# Altium schematic sheet Componets.SchDoc
size A3; SheetNumber: 1; SheetTotal: 8
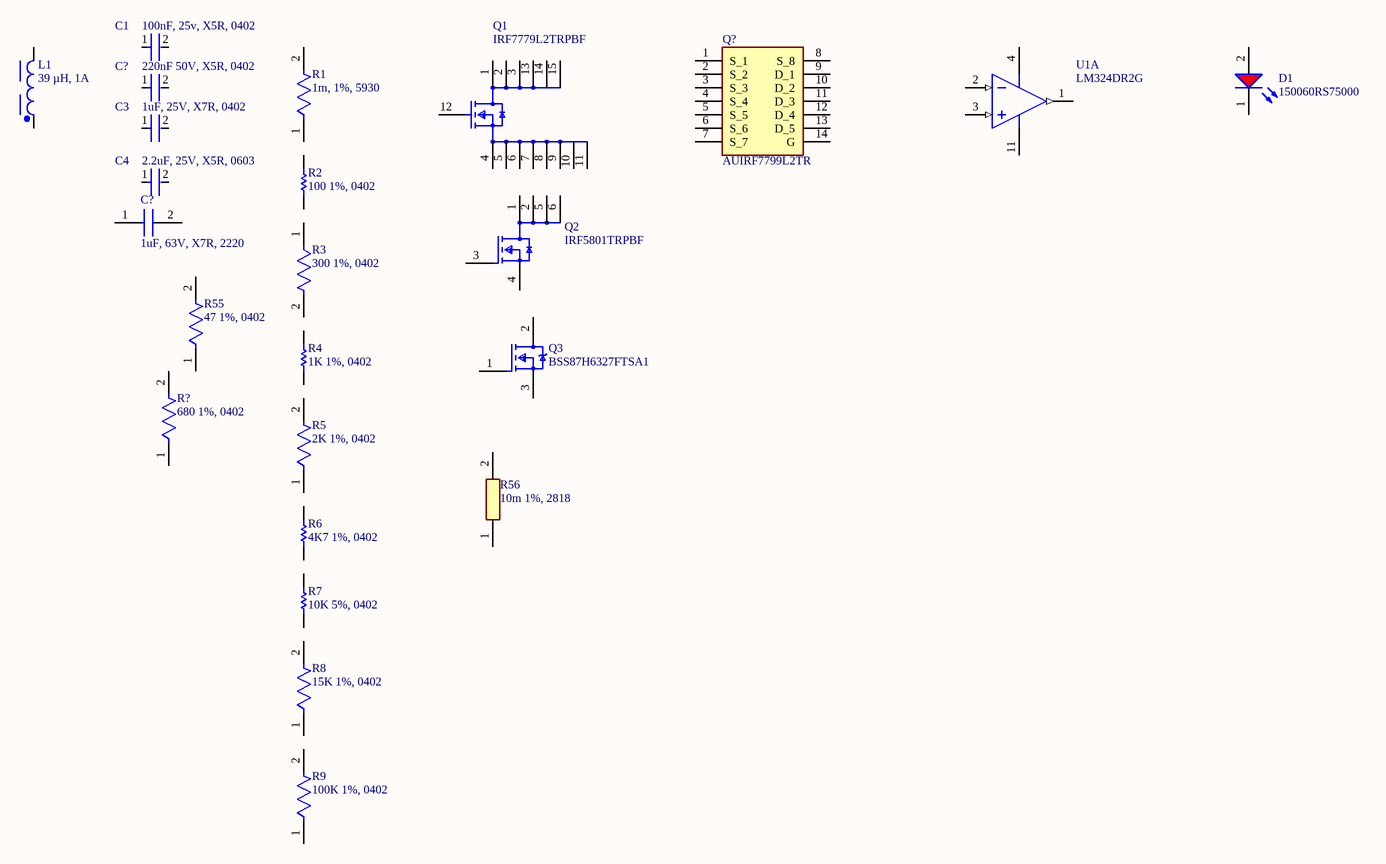
[diagram p0: Componets.SchDoc]

## Parts
(Parts that share a designator on the sheet are numbered #1, #2 ... from top to bottom, then left to right.)
C1  100nF, 25v, X5R, 0402  [FP-GRM155-0_05-IPC_C]
C3  1uF, 25V, X7R, 0402  [FP-GRM155-0_05-IPC_B]
C4  2.2uF, 25V, X5R, 0603  [FP-GRM188-0_1-e0_2_0_5-MFG]
C?#1  220nF 50V, X5R, 0402  [FP-CC0402-MFG]
C?#2  1uF, 63V, X7R, 2220  [CAPC5750X420N]
D1  150060RS75000  [WL-SMCW_0603_150060xx75000]
L1  39 µH, 1A  [WE-PD_7345]
Q1  IRF7779L2TRPBF  [FP-MG-WDSON-11-MFG]
Q2  IRF5801TRPBF  [FP-PG-TSOP-6-MFG]
Q3  BSS87H6327FTSA1  [FP-PG-SOT89-4-MFG]
Q?  AUIRF7799L2TR  [AUIRF7799L2TR]
R1  1m, 1%, 5930  [FP-CSS2H-5930K-1L00F-MFG]
R2  100 1%, 0402  [RESC1005X40X25LL05T05]
R3  300 1%, 0402  [FP-ERJ2RK-IPC_A]
R4  1K 1%, 0402  [RESC1005X40X25NL05T05]
R5  2K 1%, 0402  [FP-ERJ2RK-MFG]
R6  4K7 1%, 0402  [RESC1005X40X25LL05T05]
R7  10K 5%, 0402  [RESC1005X40X25ML05T05]
R8  15K 1%, 0402  [FP-ERJ2R-MFG]
R9  100K 1%, 0402  [FP-ERJ2RK-IPC_C]
R55  47 1%, 0402  [FP-ERJ2RK-IPC_C]
R56  10m 1%, 2818  [WSHP28181L000FEB]
R?  680 1%, 0402  [FP-ERJ2RK-MFG]
U1  LM324DR2G  [ONSC-SOIC-14-751A-03_V]  (part A of 4)

## Nets

Not connected (* = marked no-connect by the designer): C1 1 2; C3 1 2; C4 1 2; C?#1 1 2; C?#2 1 2; D1 1(K) 2(A); L1 1 2; Q1 1(Drain) 2(Drain) 3(Drain) 4(Source) 5(Source) 6(Source) 7(Source) 8(Source) 9(Source) 10(Source) 11(Source) 12(Gate) 13(Drain) 14(Drain) 15(Drain); Q2 1(D) 2(D) 3(G) 4(S) 5(D) 6(D); Q3 1(Gate) 2(Drain) 3(Source); Q? 1(S_1) 2(S_2) 3(S_3) 4(S_4) 5(S_5) 6(S_6) 7(S_7) 8(S_8) 9(D_1) 10(D_2) 11(D_3) 12(D_4) 13(D_5) 14(G); R1 1 2; R2 1 2; R3 1 2; R4 1 2; R5 1 2; R6 1 2; R7 1 2; R8 1 2; R9 1 2; R55 1 2; R56 1 2; R? 1 2; U1 1(OUT1) 2(IN1-) 3(IN1+) 4(VCC) 11(VEE/GND)

## Library data of the parts
C1 = CMP-06035-003661-1: Chip Multilayer Ceramic Capacitors for General Purpose, 0402, 0.10uF, X7R, 15%, 10%, 25V; Length: 1mm; Depth: 0.5mm; Dielectric: X7R; Voltage Rating: 25V; Lead Free: Lead Free; Case Code (Imperial): 0402; Voltage: 25V; Min Operating Temperature: -55°C; Tolerance: 10%; Dielectric Material: Ceramic; Voltage Rating (DC): 25V; Max Operating Temperature: 125°C; Capacitance: 100nF; Thickness: 0.022inch; Case/Package: 0402; Height: 0.5mm; Resistor Type: Ceramic; Weight: 0.000212oz; Case Code (Metric): 1005; Package Quantity: 10000; Termination: SMD/SMT; Width: 0.02inch; Mount: Surface Mount; Packaging: Tape and Reel
C3 = CMP-2008-04581-2: Chip Multilayer Ceramic Capacitors for General Purpose, 0402, 1.0uF, X5R, 15%, 10%, 25V; Height: 0.5mm; Voltage: 25V; Tolerance: 10%; Termination: SMD/SMT; Dielectric: X5R; REACH SVHC: No SVHC; Case Code (Imperial): 0402; Max Operating Temperature: 85°C; Lead Free: Lead Free; Case/Package: 0402; Mount: Surface Mount; Width: 0.5mm; Weight: 0.000212oz; Min Operating Temperature: -55°C; Voltage Rating (DC): 25V; Length: 1mm; Thickness: 0.022inch; Voltage Rating: 25V; Material: Ceramic; Case Code (Metric): 1005; Package Quantity: 10000; Packaging: Tape and Reel; Depth: 0.5mm; Capacitance: 1uF
C4 = CMP-2006-02820-2: Chip Multilayer Ceramic Capacitors for General Purpose, 0603, 2.2uF, X5R, 15%, 10%, 25V; Number of Pins: 2; Dielectric: X5R; Tolerance: 10%; Case Code (Imperial): 0603; Thickness: 0.035inch; Case/Package: 0603; Lead Free: Lead Free; Mount: Surface Mount; Material: Ceramic; Depth: 0.8mm; Voltage: 25V; Capacitance: 2.2uF; Min Operating Temperature: -55°C; Package Quantity: 4000; REACH SVHC: No SVHC; Resistor Type: Ceramic; Packaging: Tape and Reel; Case Code (Metric): 1608; Max Operating Temperature: 85°C; Width: 0.8mm; Termination: SMD/SMT; Voltage Rating: 25V; Length: 1.6mm; Voltage Rating (DC): 25V; Height: 0.8mm; Radiation Hardening: No; Weight: 0.000222oz
C?#1 = CMP-03422-000657-1: CAP CER 0.22UF 6.3V X5R 0402; Manufacturer Part Number: CC0402MRX5R5BB224; Manufacturer: YAGEO; Automotive Grade: NA; Material: Ceramic; Tolerance: 0.2; Temperature Coefficient: 30ppm/°C; Package: CC0402; ComponentLink2URL: http://www.yageo.com/documents/recent/UPY-GP_NP0_16V-to-50V_16.pdf; Voltage Rating: 6.3 V; Temperature Range High: +125°C; Ipc Land Pattern Name: CAPC10050X50; RoHS: TRUE; Digikey Description: CAP CER 0.22UF 6.3V X5R 0402; ComponentLink2Description: Datasheet; Automotive: No; Temperature Range Low: -55°C; Lead Free: Yes; Device Class L3: Ceramic Capacitors; Footprint Url: http://www.yageo.com/exep/pages/download/literatures/UPY-C_GEN_24.pdf; Octopart: https://octopart.com/cc0402mrx5r5bb224-yageo-71334381; Height: 0.55mm; Temperature Characteristic: X5R; Value: 220 nF; Device Class L2: Capacitors; Category: Cap; Temperature: -55°C to +125°C; Capacitance: 220 nF; Device Class L1: Passive Components; Mouser Description: Multilayer Ceramic Capacitors MLCC - SMD/SMT 220nF 6.3V X5R 20%
C?#2 = 2220Y0630105KXT: Capacitor; Manufacturer_Name: Knowles; Datasheet Link: https://www.arrow.com/en/products/2220y0630105kxt/syfer-technology; Height: 4.2mm; Manufacturer_Part_Number: 2220Y0630105KXT; Mouser Part Number: 843-2220Y0630105KX; Mouser Price/Stock: https://www.mouser.co.uk/ProductDetail/Knowles-Syfer/2220Y0630105KXT?qs=yIvl1B2wDi4MJafAlAFXPQ%3D%3D; Arrow Part Number: 2220Y0630105KXT; Arrow Price/Stock: https://www.arrow.com/en/products/2220y0630105kxt/syfer-technology
D1 = CMP-1426-00001-4: LED Low-Power Uni-Color Red 630nm 2V 2-Pin Chip 0603(1608Metric) T/R; Max Junction Temperature (Tj): 95°C; Dominant Wavelength: 625nm; Lens Style: Clear, Rectangular; Viewing Angle: 140°; Forward Current: 100mA; Max Reverse Voltage (DC): 5V; Luminous Intensity: 250mcd; Test Current: 20mA; Power Dissipation: 72mW; Max Operating Temperature: 85°C; Mount: Surface Mount; Height: 700µm; Packaging: Tape and Reel; REACH SVHC: Unknown; Case Code (Metric): 1608; Peak Wavelength: 630nm; Forward Voltage: 2V; Case/Package: 0603; Color: Red; RoHS: Compliant; Width: 800µm; Reverse Voltage: 5V; Min Operating Temperature: -40°C; Wavelength: 625nm; Case Code (Imperial): 0603; Length: 1.6mm
L1 = CMP-0227-00153-2: NexarPartId: 29930417; Max DC Current: 1.11A; Shielding: Shielded; Inductance: 39µH; Self Resonant Frequency: 11MHz; DC Resistance (DCR): 145mΩ; Tolerance: 20%; Ambient Temperature Range Low: -40°C; Width: 7.3mm; Length: 7.3mm; Number of Pins: 2; Packaging: Tape & Reel; Height: 4.5mm; Ambient Temperature Range High: 85°C; Max Operating Temperature: 125°C; Depth: 7.3mm; Min Operating Temperature: -40°C; RoHS: Compliant; Current Rating: 1.11A
Q1 = CMP-32901-000937-1: MOSFET N-CH 150V 375A DIRECTFET; Drain to Source Resistance: 11mR; Power Dissipation: 125W; Turn-On Delay Time: 16ns; Threshold Voltage: 4V; Input Capacitance: 6.66nF; Turn-Off Delay Time: 36ns; Gate to Source Voltage (Vgs): 20V; Length: 0.36inch; Number of Pins: 11; Min Operating Temperature: -55°C; Halogen Free: Halogen Free; Rds On Max: 11mR; REACH SVHC: No SVHC; Max Operating Temperature: 175°C; Continuous Drain Current (ID): 375A; Max Power Dissipation: 125W; Mount: Surface Mount; Width: 0.28inch; Max Dual Supply Voltage: 150V; Lead Free: Lead Free; Height: 0.02inch; Series: HEXFET®; RoHS Compliant: Yes; Drain to Source Voltage (Vdss): 150V; Packaging: Cut Tape
Q2 = CMP-32901-001111-1: MOSFET N-CH 200V 600MA MICRO6; Turn-On Delay Time: 6.5ns; Power Dissipation: 2W; Rds On Max: 2.2R; Polarization: N; Input Capacitance: 88pF; Turn-Off Delay Time: 8.8ns; Threshold Voltage: 5.5V; Gate to Source Voltage (Vgs): 30V; Max Dual Supply Voltage: 200V; Mount: Surface Mount; Width: 0.067inch; RoHS Compliant: Yes; Series: HEXFET®; Packaging: Cut Tape; Drain to Source Breakdown Voltage: 200V; Length: 0.118inch; Height: 0.039inch; Number of Pins: 6; Case/Package: TSOP; Halogen Free: Halogen Free; Drain to Source Voltage (Vdss): 200V; Min Operating Temperature: -55°C; Reach SVHC Compliant: Yes; Max Operating Temperature: 150°C; Lead Free: Lead Free; Max Power Dissipation: 2W; Continuous Drain Current (ID): 600mA; Drain to Source Resistance: 2.2R
Q3 = CMP-32901-001322-1: MOSFET N-CH 240V 260MA SOT89-4; Input Capacitance: 97pF; Drain to Source Resistance: 3.9R; Rise Time: 3.5ns; Rds On Max: 6R; Fall Time: 27.3ns; Turn-On Delay Time: 3.7ns; Number of Elements: 1; Power Dissipation: 1W; Element Configuration: Single; Gate to Source Voltage (Vgs): 20V; Polarity: N-CHANNEL; Turn-Off Delay Time: 17.6ns; Case/Package: SOT-89; Max Dual Supply Voltage: 240V; Drain to Source Voltage (Vdss): 240V; Lead Free: Lead Free; Package Quantity: 1000; Halogen Free: Not Halogen Free; RoHS Compliant: Yes; Width: 2.5mm; Length: 4.5mm; Mount: Surface Mount; Packaging: Tape and Reel; Max Power Dissipation: 1W; Height: 1.5mm; Max Operating Temperature: 150°C; Series: SIPMOS®; Drain to Source Breakdown Voltage: 240V; Min Operating Temperature: -55°C; Number of Pins: 3; Continuous Drain Current (ID): 260mA
Q? = AUIRF7799L2TR: MOSFET (N-Channel); Manufacturer_Name: Infineon; Datasheet Link: https://www.infineon.com/dgdl/auirf7799l2.pdf?fileId=5546d462533600a4015355b0ca251410; Height: 0.74mm; Manufacturer_Part_Number: AUIRF7799L2TR; Mouser Part Number: 942-AUIRF7799L2TR; Mouser Price/Stock: https://www.mouser.co.uk/ProductDetail/Infineon-Technologies/AUIRF7799L2TR?qs=XJ2d94E3icZZf5CL1PjSkA%3D%3D
R1 = CMP-00059-73869598-1: CSS2H-5930K-1L00F Res Metal Strip 5930 0.001 Ohm 1% 9W ±50ppm/C Pad SMD Automotive T/R; Resistance: 1mΩ; Temperature Coefficient: 50ppm/°C; Case Code (Imperial): 5931; Width: 7.747mm; Min Operating Temperature: -55°C; Tolerance: 1%; Max Power Dissipation: 9W; Case Code (Metric): 1577; Max Operating Temperature: 170°C; NexarPartId: 73869598; Power Rating: 9W; Composition: Metal Element; Case/Package: 5930; Height: 939.8µm; Number of Terminations: 2; Schedule B: 8533210045, 8533210045; Packaging: Cut Tape; REACH SVHC: No SVHC; Features: Moisture Resistant; RoHS: Compliant; Length: 15.0114mm
R2 = CMP-2002-00605-3: Chip Resistor, 100 Ohm, +/- 1%, 100 mW, -55 to 155 degC, 0402 (1005 Metric), RoHS, Tape and Reel; Manufacturer: Basic Passives; PartNumber: ERJ-2RKF1000X; Power Rating: 100 mW; Resistance: 100 Ohm; Voltage Rating: 50 V; Case\/Package: 0402; Width: 0.5 mm; Pins: 2; ComponentLink2Description: Datasheet; PackageReference: 0402; Height: 0.35 mm; Tolerance: 1%; DatasheetVersion: 04/2015; Case Code (Imperial): 0402; Min Operating Temperature: -55 degC; Radiation Hardening: No; Length: 1 mm; Package Quantity: 10000; PackageDescription: 2-Pin Surface Mount Device, Body 1 x 0.5 mm; Mounting Technology: Surface Mount; Case Code (Metric): 1005; Packaging: Tape and Reel; ComponentLink1URL: http://www.panasonic.com/; RoHSCompliant: true; Max Operating Temperature: 155 degC; REACH SVHC: Yes; ComponentLink1Description: Manufacturer URL; ComponentLink2URL: http://industrial.panasonic.com/cdbs/www-data/pdf/RDA0000/AOA0000C86.pdf; Mount: Surface Mount
R3 = CMP-1011-00449-3: RES SMD 300 OHM 1% 1/10W 0402; Power Rating: 100mW; Voltage Rating: 50V; Temperature Coefficient: 100ppm/°C; Resistance: 300R; Case Code (Imperial): 0402; Termination: SMD/SMT; REACH SVHC: No SVHC; Number of Terminations: 2; Composition: Thick Film; Case Code (Metric): 1005; Voltage Rating (DC): 50V; Packaging: Tape and Reel; Max Power Dissipation: 100mW; Tolerance: 1%; Lead Free: Lead Free; Military Standard: Not; Mount: Surface Mount; Height: 0.35mm; Package Quantity: 10000; Max Operating Temperature: 155°C; Depth: 0.5mm; Min Operating Temperature: -55°C; Length: 1mm; Contact Plating: Tin; Width: 0.02inch; Case/Package: 0402
R4 = CMP-1011-00510-4: Chip Resistor, 1 KOhm, +/- 1%, 100 mW, -55 to 155 degC, 0402 (1005 Metric), RoHS, Tape and Reel; PartNumber: ERJ-2RKF1001X; Manufacturer: Basic Passives; Voltage Rating: 50 V; Case\/Package: 0402; Resistance: 1 KOhm; Power Rating: 100 mW; DatasheetVersion: 04/2015; Radiation Hardening: No; Pins: 2; Height: 0.35 mm; RoHSCompliant: true; Case Code (Imperial): 0402; ComponentLink2Description: Datasheet; ComponentLink1Description: Manufacturer URL; PackageReference: 0402; Mount: Surface Mount; Package Quantity: 10000; Tolerance: 1%; ComponentLink1URL: http://www.panasonic.com/; PackageDescription: 2-Pin Surface Mount Device, Body 1 x 0.5 mm; Mounting Technology: Surface Mount; Case Code (Metric): 1005; ComponentLink2URL: http://industrial.panasonic.com/cdbs/www-data/pdf/RDA0000/AOA0000C86.pdf; REACH SVHC: Yes; Packaging: Tape and Reel; Max Operating Temperature: 155 degC; Min Operating Temperature: -55 degC; Width: 0.5 mm; Length: 1 mm
R5 = CMP-2002-00758-4: RES SMD 2K OHM 1% 1/10W 0402; Temperature Coefficient: 100ppm/°C; Max Power Dissipation: 100mW; Working Voltage: 50V; Resistance: 2kR; Number of Terminations: 2; Technology: THICK FILM; Packaging: Tape and Reel; RoHS Compliant: Yes; Min Operating Temperature: -55°C; Length: 1mm; Construction: Rectangular; Features: Automotive AEC-Q200; Contact Plating: Tin; Lead Free: Lead Free; Series: ERJ; Power Rating: 100mW; REACH SVHC: No SVHC; Resistor Type: Thick Film; Max Operating Temperature: 155°C; Package Quantity: 10000; Height: 0.35mm; Case/Package: 0402; Tolerance: 1%; Mount: Surface Mount; Termination: SMD/SMT; Resistance Tolerance: 1%; Depth: 0.5mm; Voltage Rating (DC): 50V; Voltage Rating: 50V; Case Code (Imperial): 0402; Military Standard: Not; Width: 0.02inch; Radiation Hardening: No; Case Code (Metric): 1005
R6 = CMP-2002-01154-4: Chip Resistor, 4.7 KOhm, +/- 1%, 0.1 W, -55 to 155 degC, 0402 (1005 Metric), RoHS, Tape and Reel; PartNumber: ERJ-2RKF4701X; Voltage Rating: 50 V; Case\/Package: 0402; Power Rating: 100 mW; Height: 0.35 mm; Mounting Technology: Surface Mount; REACH SVHC: Yes; Resistance: 4.7 KOhm; Max Operating Temperature: 155 degC; ComponentLink1Description: Manufacturer URL; ComponentLink2Description: Datasheet; Pins: 2; PackageReference: 0402; Tolerance: 1%; Case Code (Imperial): 0402; Length: 1 mm; PackageDescription: 2-Pin Surface Mount Device, Body 1 x 0.5 mm; RoHSCompliant: true; Package Quantity: 1; Radiation Hardening: No; DatasheetVersion: 04/2015; Width: 0.5 mm; Case Code (Metric): 1005; Mount: Surface Mount; ComponentLink1URL: http://www.panasonic.com/; Min Operating Temperature: -55 degC; Packaging: Cut Tape; ComponentLink2URL: http://industrial.panasonic.com/cdbs/www-data/pdf/RDA0000/AOA0000C86.pdf
R7 = CMP-2002-00433-1: Part Number: ERJ-2GEJ103X; Manufacturer: Panasonic
R8 = CMP-2002-00694-4: RES SMD 15K OHM 1% 1/10W 0402; Manufacturer Part Number: ERJ-2RKF1502X; Manufacturer: Panasonic; Automotive Grade: Grade 0; Voltage Rating: 50V; Resistance: 15kΩ; Temperature Coefficient: 100ppm/°C; Power Rating: 0.1W; Value: 15kΩ; ComponentLink2URL: https://industrial.panasonic.com/cdbs/www-data/pdf/RDA0000/AOA0000C304.pdf; Automotive: Yes; Temperature: -55°C to +155°C; Height: 0.4mm; Digikey Description: RES SMD 15K OHM 1% 1/10W 0402; Category: Res; Device Class L2: Resistors; Device Class L1: Passive Components; Package: ERJ2R; Temperature Range Low: -55°C; Tolerance: 1%; Series: ERJ; Footprint Url: https://b2b-api.panasonic.eu/file_stream/pids/fileversion/1180; Mouser Description: Res Thick Film 1.0 x 0.5 mm 15K Ohm 1% 0.1W(1/10W) 100ppm/ C Molded SMD Punched Carrier T/R; Composition: Thick Film; Lead Free: Yes; Device Class L3: Chip SMD Resistors; Octopart: https://octopart.com/erj-2rkf1502x-panasonic-55404985; RoHS: TRUE; Temperature Range High: +155°C; ComponentLink2Description: Datasheet
R9 = CMP-2002-00608-4: RES SMD 100K OHM 1% 1/10W 0402; Resistance: 100kR; Voltage Rating (DC): 50V; Power Rating: 100mW; Temperature Coefficient: 100ppm/°C; Case/Package: 0402; Length: 1mm; Package Quantity: 1; Radiation Hardening: No; Case Code (Metric): 1005; Contact Plating: Tin; Mount: Surface Mount; Depth: 0.5mm; Max Operating Temperature: 155°C; Lead Free: Lead Free; Width: 0.5mm; Composition: Thick Film; Case Code (Imperial): 0402; Tolerance: 1%; Termination: SMD/SMT; Number of Pins: 2; Height: 0.35mm; Voltage Rating: 50V; Military Standard: Not; REACH SVHC: No SVHC; Packaging: Tape and Reel; Min Operating Temperature: -55°C; Max Power Dissipation: 100mW; Features: Automotive AEC-Q200; Number of Terminations: 2
R55 = CMP-1011-00360-3: RES SMD 47 OHM 1% 1/10W 0402; Resistance: 47R; Power Rating: 100mW; Temperature Coefficient: 100ppm/°C; Voltage Rating (DC): 50V; Case Code (Imperial): 0402; Width: 0.02inch; Height: 0.35mm; Features: Automotive AEC-Q200; Case/Package: 0402; RoHS Compliant: Yes; Lead Free: Lead Free; Case Code (Metric): 1005; Technology: THICK FILM; Termination: SMD/SMT; Tolerance: 1%; Resistance Tolerance: 1%; Max Operating Temperature: 155°C; Construction: Rectangular; Mount: Surface Mount; Min Operating Temperature: -55°C; Max Power Dissipation: 100mW; Number of Terminations: 2; Military Standard: Not; REACH SVHC: No SVHC; Resistor Type: Thick Film; Contact Plating: Tin; Package Quantity: 1; Series: ERJ; Packaging: Tape and Reel; Voltage Rating: 50V; Weight: 2.8E-05oz; Length: 1mm; Number of Pins: 2; Depth: 0.5mm
R56 = WSHP2818R0100FEA: Resistor; Manufacturer_Name: Vishay; Datasheet Link: http://www.vishay.com/docs/30347/wshp2818.pdf; Height: 1mm; Manufacturer_Part_Number: WSHP2818R0100FEA; Mouser Part Number: 71-WSHP2818R0100FEA; Mouser Price/Stock: https://www.mouser.co.uk/ProductDetail/Vishay-Dale/WSHP2818R0100FEA?qs=WY0B%252Bpw29jNppYK03UGNJA%3D%3D; Arrow Part Number: WSHP2818R0100FEA; Arrow Price/Stock: https://www.arrow.com/en/products/wshp2818r0100fea/vishay?region=nac
R? = CMP-2002-01166-2: NexarPartId: 12588708; Power Rating: 100mW; Voltage Rating: 50V; Temperature Coefficient: 100ppm/°C; Resistance: 680Ω; Military Standard: Not; Width: 508µm; Case/Package: 0402; Termination: SMD/SMT; Depth: 500µm; Min Operating Temperature: -55°C; REACH SVHC: No SVHC; Contact Plating: Tin; Max Power Dissipation: 100mW; Number of Terminations: 2; RoHS: Compliant; Length: 1mm; Case Code (Metric): 1005; Tolerance: 1%; Schedule B: 8533210045, 8533210045; Mount: Surface Mount; Features: Automotive AEC-Q200; Number of Pins: 2; Height: 350µm; Radiation Hardening: No; Packaging: Cut Tape; Voltage Rating (DC): 50V; Lifecycle Status: Production; Case Code (Imperial): 0402; Lead Free: Lead Free; Composition: Thick Film; Max Operating Temperature: 155°C
U1 = CMP-1310-00171-1: Single Supply Quad Operational Amplifier, 3 to 32 V, 0 to 70 degC, 14-Pin SOIC, Pb-Free, Tape and Reel; Manufacturer: On Semiconductor; VCC Max (V): 32; VCC Min (V): 3; PackageVersion: Rev. K, 05/2011; ComponentLink3URL: http://www.onsemi.com/pub_link/Collateral/751A-03.PDF; ComponentLink3Description: Package Specification; Packing: Tape and Reel; ComponentLink2URL: http://www.onsemi.cn/pub_link/Collateral/LM324-D.PDF; PackageReference: SOIC-14-751A-03; ComponentLink1URL: http://www.onsemi.com/; PackageDescription: 14-Pin Small Outline Integrated Circuit, Body 8.65 x 3.9 mm, Pitch 1.27 mm; ComponentLink1Description: Manufacturer URL; DatasheetVersion: Rev. 25; Mounting Technology: Surface Mount; RoHS: TRUE; ComponentLink2Description: Datasheet; PartNumber: LM324DR2G